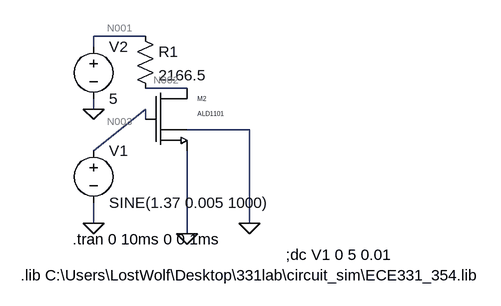
[diagram p0: schematic Draft1.asc]
Draft1.asc, the LTspice schematic file:
Version 4
SHEET 1 880 680
WIRE 16 0 -64 0
WIRE -64 16 -64 0
WIRE 80 80 16 80
WIRE -64 112 -64 96
WIRE 16 128 16 112
WIRE 176 144 80 144
WIRE -64 176 16 112
WIRE -64 288 -64 256
WIRE 176 288 176 144
WIRE 80 304 80 176
FLAG 80 304 0
FLAG -64 288 0
FLAG -64 112 0
FLAG 176 288 0
SYMBOL voltage -64 160 R0
WINDOW 123 0 0 Left 2
WINDOW 39 0 0 Left 2
SYMATTR InstName V1
SYMATTR Value SINE(1.37 0.005 1000)
SYMBOL voltage -64 0 R0
WINDOW 123 0 0 Left 2
WINDOW 39 0 0 Left 2
SYMATTR InstName V2
SYMATTR Value 5
SYMBOL res 0 -16 R0
SYMATTR InstName R1
SYMATTR Value 2166.5
SYMBOL ALD1101 16 80 R0
SYMATTR InstName M2
TEXT -96 312 Left 2 !.tran 0 10ms 0 0.1ms
TEXT -176 368 Left 2 !.lib C:\\Users\\LostWolf\\Desktop\\331lab\\circuit_sim\\ECE331_354.lib
TEXT 232 336 Left 2 !;dc V1 0 5 0.01

The netlist it stands for:
* Draft1.asc
V1 N003 0 SINE(1.37 0.005 1000)
V2 N001 0 5
R1 N001 N002 2166.5
M2 N002 N003 0 0 ALD1101 W=1.379e-3 L=1E-6
.model NMOS NMOS
.model PMOS PMOS
.lib standard.mos
.tran 0 10ms 0 0.1ms
.lib C:\Users\LostWolf\Desktop\331lab\circuit_sim\ECE331_354.lib
;dc V1 0 5 0.01
.backanno
.end

* Results of the author's LTspice run, read from the files saved beside the schematic
* Operating Point, zero values left out:
*   V(n003) = 1.37 V
*   V(n001) = 5 V
*   V(n002) = 2.767 V
*   Id(M2) = 1.03 mA
*   Ib(M2) = -2.785 pA
*   Is(M2) = -1.03 mA
*   I(R1) = 1.03 mA
*   I(V2) = -1.03 mA
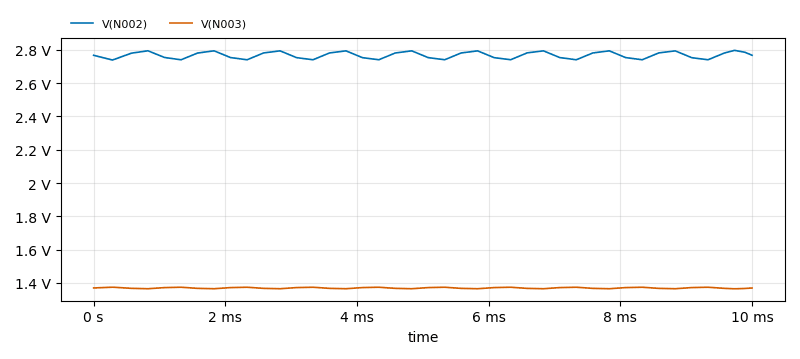
[diagram p1: Transient Analysis of Draft1.asc, plotted from the saved traces]
* Transient Analysis, 1 run:
*   V(N002): min 2.739 V, max 2.797 V, average 2.768 V, rms 2.768 V, last 2.767 V
*   V(N003): min 1.365 V, max 1.375 V, average 1.37 V, rms 1.37 V, last 1.37 V